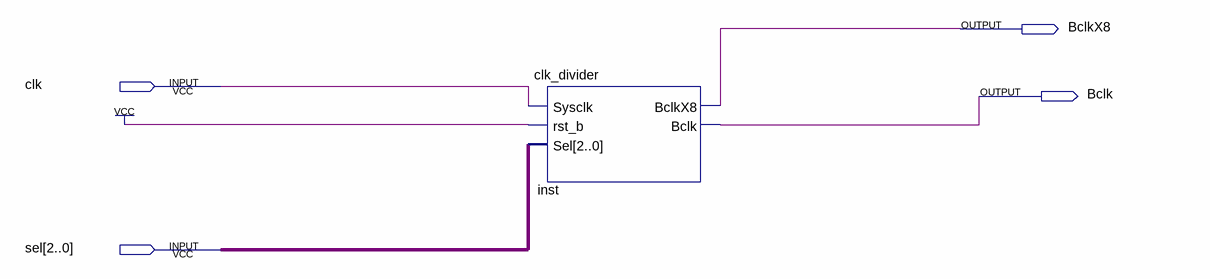
[diagram p0: schematic sheet]
// Quartus schematic baud_test.bdf as structural Verilog: 1 symbols, 4 pins
module baud_test (
  input  clk,
  input  [2:0] sel,
  output BclkX8,
  output Bclk
);

  clk_divider inst (.Sysclk(clk), .rst_b(1'b1), .Sel(sel), .BclkX8(BclkX8), .Bclk(Bclk));
endmodule
